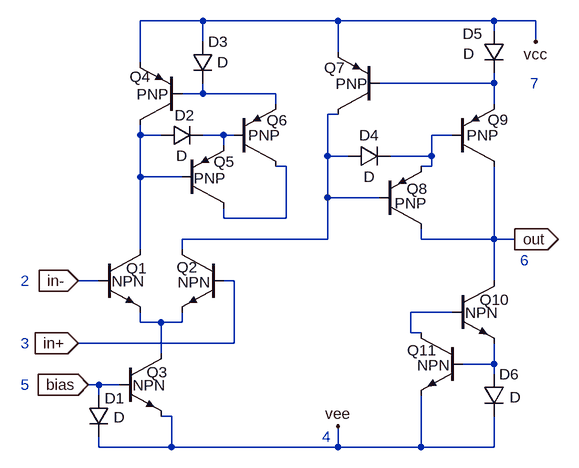
[diagram p0: schematic Ca3080.asc]
Ca3080.asc, the LTspice schematic file:
Version 4
SHEET 1 880 700
WIRE -256 416 -288 416
WIRE -256 576 -272 576
WIRE -256 592 -256 576
WIRE -256 672 -256 656
WIRE -224 576 -256 576
WIRE -192 80 -192 16
WIRE -192 192 -192 176
WIRE -192 256 -192 192
WIRE -192 368 -192 256
WIRE -192 480 -192 464
WIRE -160 192 -192 192
WIRE -160 480 -192 480
WIRE -160 528 -160 480
WIRE -144 624 -160 624
WIRE -144 672 -256 672
WIRE -144 672 -144 624
WIRE -128 256 -192 256
WIRE -128 368 -128 352
WIRE -128 480 -160 480
WIRE -128 480 -128 464
WIRE -96 16 -192 16
WIRE -96 48 -96 16
WIRE -96 128 -128 128
WIRE -96 128 -96 112
WIRE -64 192 -96 192
WIRE -64 208 -64 192
WIRE -64 320 -64 304
WIRE -48 192 -64 192
WIRE -48 416 -64 416
WIRE -48 512 -288 512
WIRE -48 512 -48 416
WIRE 16 128 -96 128
WIRE 16 144 16 128
WIRE 32 240 16 240
WIRE 32 320 -64 320
WIRE 32 320 32 240
WIRE 96 224 96 160
WIRE 96 288 96 224
WIRE 96 352 -128 352
WIRE 96 352 96 288
WIRE 112 16 -96 16
WIRE 112 64 112 16
WIRE 112 160 96 160
WIRE 112 672 -144 672
WIRE 112 672 112 640
WIRE 128 224 96 224
WIRE 176 288 96 288
WIRE 224 496 224 464
WIRE 240 352 240 336
WIRE 240 496 224 496
WIRE 240 672 112 672
WIRE 240 672 240 592
WIRE 256 224 192 224
WIRE 256 224 256 192
WIRE 256 240 240 240
WIRE 256 240 256 224
WIRE 288 192 256 192
WIRE 288 464 224 464
WIRE 352 16 112 16
WIRE 352 32 352 16
WIRE 352 112 176 112
WIRE 352 112 352 96
WIRE 352 144 352 112
WIRE 352 352 240 352
WIRE 352 352 352 240
WIRE 352 416 352 352
WIRE 352 544 304 544
WIRE 352 544 352 512
WIRE 352 560 352 544
WIRE 352 672 240 672
WIRE 352 672 352 624
WIRE 384 352 352 352
WIRE 416 16 352 16
WIRE 416 48 416 16
FLAG -288 416 in-
IOPIN -288 416 In
FLAG -288 512 in+
IOPIN -288 512 In
FLAG -272 576 bias
IOPIN -272 576 In
FLAG 112 640 vee
FLAG 384 352 out
IOPIN 384 352 Out
FLAG 416 48 vcc
SYMBOL pnp2 -128 176 R180
WINDOW 0 48 74 Left 0
WINDOW 3 21 47 Left 0
SYMATTR InstName Q4
SYMBOL pnp2 -48 240 M180
WINDOW 0 50 71 Left 0
WINDOW 3 22 48 Left 0
SYMATTR InstName Q6
SYMBOL pnp2 -128 304 M180
WINDOW 0 49 71 Left 0
WINDOW 3 18 46 Left 0
SYMATTR InstName Q5
SYMBOL diode -112 48 R0
WINDOW 3 38 32 Left 0
SYMATTR InstName D3
SYMBOL diode -160 208 R270
WINDOW 0 31 36 VTop 0
WINDOW 3 0 32 VBottom 0
SYMATTR InstName D2
SYMBOL pnp2 176 160 R180
WINDOW 0 53 72 Left 0
WINDOW 3 19 47 Left 0
SYMATTR InstName Q7
SYMBOL npn2 -256 368 R0
WINDOW 0 42 29 Left 0
WINDOW 3 20 49 Left 0
SYMATTR InstName Q1
SYMBOL npn2 -64 368 M0
WINDOW 0 40 27 Left 0
WINDOW 3 20 50 Left 0
SYMATTR InstName Q2
SYMBOL npn2 -224 528 R0
WINDOW 0 42 29 Left 0
WINDOW 3 20 49 Left 0
SYMATTR InstName Q3
SYMBOL diode -272 592 R0
WINDOW 0 25 5 Left 0
WINDOW 3 39 34 Left 0
SYMATTR InstName D1
SYMBOL pnp2 176 336 M180
WINDOW 0 42 62 Left 0
WINDOW 3 23 39 Left 0
SYMATTR InstName Q8
SYMBOL diode 128 240 R270
WINDOW 0 32 32 VTop 0
WINDOW 3 0 32 VBottom 0
SYMATTR InstName D4
SYMBOL pnp2 288 240 M180
WINDOW 0 54 72 Left 0
WINDOW 3 22 48 Left 0
SYMATTR InstName Q9
SYMBOL diode 336 32 R0
WINDOW 0 -32 4 Left 0
WINDOW 3 -31 35 Left 0
SYMATTR InstName D5
SYMBOL npn2 288 416 R0
WINDOW 0 42 29 Left 0
WINDOW 3 20 49 Left 0
SYMATTR InstName Q10
SYMBOL npn2 304 496 M0
WINDOW 0 40 27 Left 0
WINDOW 3 20 50 Left 0
SYMATTR InstName Q11
SYMBOL diode 336 560 R0
WINDOW 3 40 35 Left 0
SYMATTR InstName D6
TEXT -376 416 Left 0 ;2
TEXT -376 512 Left 0 ;3
TEXT -376 576 Left 0 ;5
TEXT 88 656 Left 0 ;4
TEXT 392 384 Left 0 ;6
TEXT 408 112 Left 0 ;7

The netlist it stands for:
* Ca3080.asc
Q4 N001 N004 vcc 0 PNP
Q6 N006 N005 N004 0 PNP
Q5 N006 N001 N005 0 PNP
D3 vcc N004 D
D2 N001 N005 D
Q7 N003 N009 vcc 0 PNP
Q1 N001 in- N002 0 NPN
Q2 N003 in+ N002 0 NPN
Q3 N002 bias vee 0 NPN
D1 bias vee D
Q8 out N003 N008 0 PNP
D4 N003 N008 D
Q9 out N008 N009 0 PNP
D5 vcc N009 D
Q10 out N007 N010 0 NPN
Q11 N007 N010 vee 0 NPN
D6 N010 vee D
.model D D
.lib standard.dio
.model NPN NPN
.model PNP PNP
.lib standard.bjt
* 2
* 3
* 5
* 4
* 6
* 7
.backanno
.end